# Altium schematic sheet USB3toTF.SchDoc
size A4; SheetNumber: 3; SheetTotal: 5
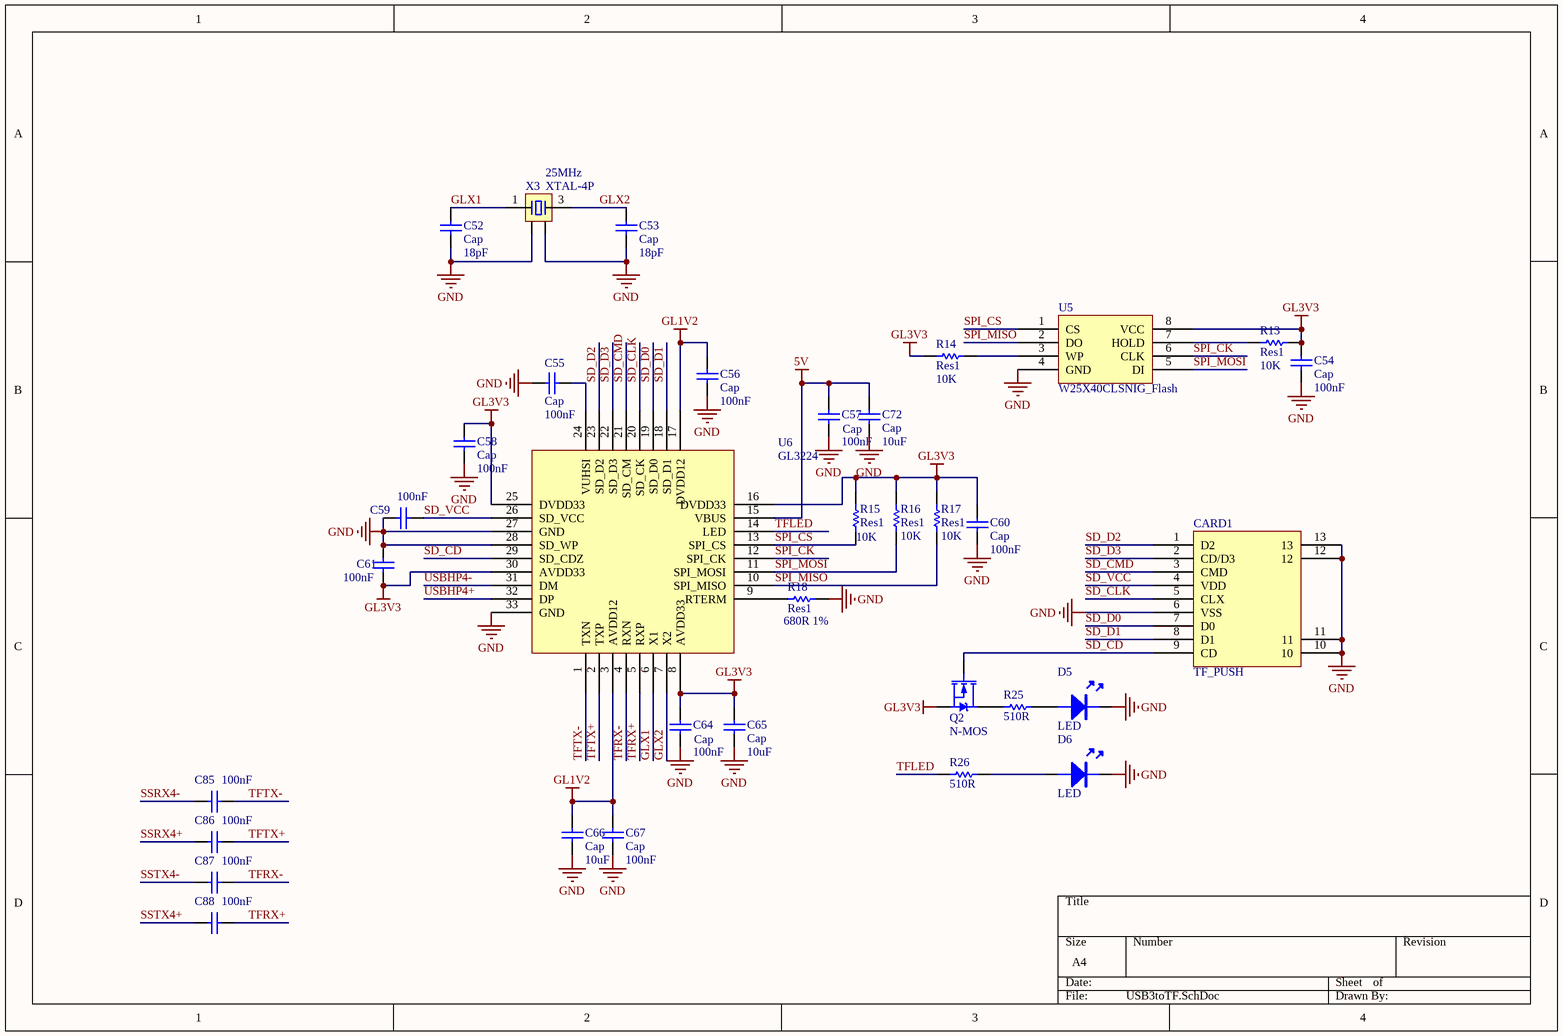
[diagram p0: USB3toTF.SchDoc]

## Parts
C52  Cap  value 18pF  [C0603_M]
C53  Cap  value 18pF  [C0603_M]
C54  Cap  value 100nF  [C0603_M]
C55  Cap  value 100nF  [C0603_M]
C56  Cap  value 100nF  [C0603_M]
C57  Cap  value 100nF  [C0603_M]
C58  Cap  value 100nF  [C0603_M]
C59  value 100nF  [C0603_M]  (hidden comment: Cap)
C60  Cap  value 100nF  [C0603_M]
C61  value 100nF  [C0603_M]  (hidden comment: Cap)
C64  Cap  value 100nF  [C0603_M]
C65  Cap  value 10uF  [C0603_M]
C66  Cap  value 10uF  [C0603_M]
C67  Cap  value 100nF  [C0603_M]
C72  Cap  value 10uF  [C0603_M]
C85  value 100nF  [C0402_M]  (hidden comment: Cap)
C86  value 100nF  [C0402_M]  (hidden comment: Cap)
C87  value 100nF  [C0402_M]  (hidden comment: Cap)
C88  value 100nF  [C0402_M]  (hidden comment: Cap)
CARD1  TF_PUSH  [TF-SMD_TF-PUSH]
D5  LED  [LED0402_B]
D6  LED  [LED0402_B]
Q2  N-MOS  [SOT-723_L1.2-W0.8-P0.40-LS1.2-BR]
R13  Res1  value 10K  [R0603_M]
R14  Res1  value 10K  [R0603_M]
R15  Res1  value 10K  [R0603_M]
R16  Res1  value 10K  [R0603_M]
R17  Res1  value 10K  [R0603_M]
R18  Res1  value 680R 1%  [R0603_M]
R25  value 510R  [R0603_M]  (hidden comment: Res1)
R26  value 510R  [R0603_M]  (hidden comment: Res1)
U5  W25X40CLSNIG_Flash  [SOP8_M]
U6  GL3224  [QFN32 5x5_M]
X3  XTAL-4P  Parameter 1: 25MHz  [OSC 3225-4P]

## Nets
5V: C57.1 C72.1 U6.15(VBUS)
GL1V2: C56.2 C66.1 C67.1 U6.3(AVDD12) U6.17(DVDD12)
GL3V3: C54.1 C58.2 C60.2 C61.2 C64.1 C65.1 Q2.S R13.2 R14.1 R15.2 R16.2 R17.2 U5.8(VCC) U6.8(AVDD33) U6.16(DVDD33) U6.25(DVDD33) U6.30(AVDD33)
GND: C52.2 C53.2 C54.2 C55.1 C56.1 C57.2 C58.1 C59.2 C60.1 C61.1 C64.2 C65.2 C66.2 C67.2 C72.2 CARD1.6(VSS) CARD1.10 CARD1.11 CARD1.12 CARD1.13 D5.K D6.K R18.2 U5.4(GND) U6.27(GND) U6.28(SD_WP) U6.33(GND) X3.2 X3.4
GLX1: C52.1 U6.6(X1) X3.1
GLX2: C53.1 U6.7(X2) X3.3
SD_CD: CARD1.9(CD) Q2.G U6.29(SD_CDZ)
SD_CLK: CARD1.5(CLX) U6.20(SD_CK)
SD_CMD: CARD1.3(CMD) U6.21(SD_CM)
SD_D0: CARD1.7(D0) U6.19(SD_D0)
SD_D1: CARD1.8(D1) U6.18(SD_D1)
SD_D2: CARD1.1(D2) U6.23(SD_D2)
SD_D3: CARD1.2(CD/D3) U6.22(SD_D3)
SD_VCC: C59.1 CARD1.4(VDD) U6.26(SD_VCC)
SPI_CK: U5.6(CLK) U6.12(SPI_CK)
SPI_CS: R15.1 U5.1(CS) U6.13(SPI_CS)
SPI_MISO: R17.1 U5.2(DO) U6.10(SPI_MISO)
SPI_MOSI: R16.1 U5.5(DI) U6.11(SPI_MOSI)
SSRX4+: C86.2
SSRX4-: C85.2
SSTX4+: C88.2
SSTX4-: C87.2
TFLED: R26.2 U6.14(LED)
TFRX+: C88.1 U6.5(RXP)
TFRX-: C87.1 U6.4(RXN)
TFTX+: C86.1 U6.2(TXP)
TFTX-: C85.1 U6.1(TXN)
USBHP4+: U6.32(DP)
USBHP4-: U6.31(DM)
NetC55_2: C55.2 U6.24(VUHSI)
NetD5_A: D5.A R25.1
NetD6_A: D6.A R26.1
NetQ2_D: Q2.D R25.2
NetR13_1: R13.1 U5.7(HOLD)
NetR14_2: R14.2 U5.3(WP)
NetR18_1: R18.1 U6.9(RTERM)

## Library data of the parts
C52-C61 C64-C67 C72 C85-C88 = Cap: Capacitor; Published: 8-Jun-2000; LatestRevisionDate: 17-Jul-2002; LatestRevisionNote: Re-released for DXP Platform.; PackageReference: RAD-0.3; Publisher: Altium Limited; PackageDescription: Radial Cap, Thru-Hole; 2 Leads; 0.3 in Pin Spacing
D5 D6 = LED: pin to pad: A>1 K>2
Q2 = N-MOS: N沟道场效应管; pin to pad: D>3 G>1 S>2
R13-R18 R25 R26 = Res1: Resistor; Published: 8-Jun-2000; LatestRevisionDate: 17-Jul-2002; LatestRevisionNote: Re-released for DXP Platform.; PackageReference: AXIAL-0.3; Publisher: Altium Limited; PackageDescription: Axial Device, Thru-Hole; 2 Leads; 0.3 in Pin Spacing
X3 = XTAL-4P: 4脚无源晶振